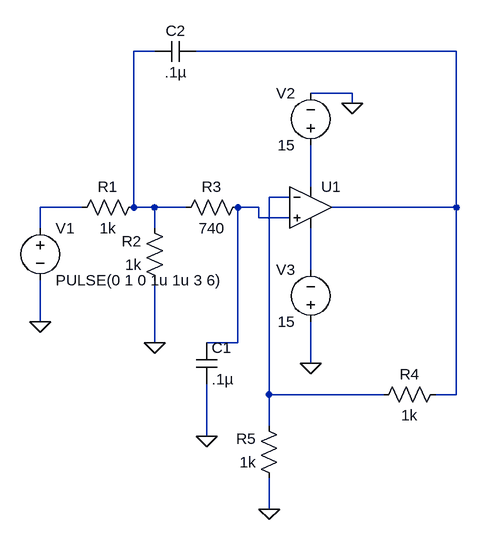
[diagram p0: schematic proj2circuit2.asc]
proj2circuit2.asc, the LTspice schematic file:
Version 4
SHEET 1 880 680
WIRE 48 -224 16 -224
WIRE 512 -224 112 -224
WIRE 352 -160 288 -160
WIRE 352 -144 352 -160
WIRE 288 -16 288 -80
WIRE 256 0 224 0
WIRE -64 16 -128 16
WIRE 16 16 16 -224
WIRE 48 16 16 16
WIRE 96 16 48 16
WIRE 208 16 176 16
WIRE 512 16 512 -224
WIRE 512 16 320 16
WIRE 208 32 208 16
WIRE 256 32 208 32
WIRE -128 48 -128 16
WIRE 48 48 48 16
WIRE 288 112 288 48
WIRE -128 192 -128 128
WIRE 48 224 48 128
WIRE 176 224 176 16
WIRE 176 224 128 224
WIRE 288 256 288 192
WIRE 224 304 224 0
WIRE 400 304 224 304
WIRE 512 304 512 16
WIRE 512 304 480 304
WIRE 224 352 224 304
WIRE 128 368 128 288
WIRE 224 480 224 432
FLAG -128 192 0
FLAG 352 -144 0
FLAG 288 256 0
FLAG 48 224 0
FLAG 128 368 0
FLAG 224 480 0
SYMBOL OpAmps\\UniversalOpamp2 288 16 R0
SYMATTR InstName U1
SYMBOL voltage -128 32 R0
WINDOW 123 0 0 Left 0
WINDOW 39 0 0 Left 0
SYMATTR InstName V1
SYMATTR Value PULSE(0 1 0 1u 1u 3 6)
SYMBOL voltage 288 -64 R180
WINDOW 0 24 96 Left 2
WINDOW 3 24 16 Left 2
WINDOW 123 0 0 Left 0
WINDOW 39 0 0 Left 0
SYMATTR InstName V2
SYMATTR Value 15
SYMBOL voltage 288 208 R180
WINDOW 0 24 96 Left 2
WINDOW 3 24 16 Left 2
WINDOW 123 0 0 Left 0
WINDOW 39 0 0 Left 0
SYMATTR InstName V3
SYMATTR Value 15
SYMBOL res 32 0 R90
WINDOW 0 0 56 VBottom 2
WINDOW 3 32 56 VTop 2
SYMATTR InstName R1
SYMATTR Value 1k
SYMBOL res 64 144 R180
WINDOW 0 36 76 Left 2
WINDOW 3 36 40 Left 2
SYMATTR InstName R2
SYMATTR Value 1k
SYMBOL res 192 0 R90
WINDOW 0 0 56 VBottom 2
WINDOW 3 32 56 VTop 2
SYMATTR InstName R3
SYMATTR Value 740
SYMBOL res 496 288 R90
WINDOW 0 0 56 VBottom 2
WINDOW 3 32 56 VTop 2
SYMATTR InstName R4
SYMATTR Value 1k
SYMBOL res 240 448 R180
WINDOW 0 36 76 Left 2
WINDOW 3 36 40 Left 2
SYMATTR InstName R5
SYMATTR Value 1k
SYMBOL cap 112 224 R0
SYMATTR InstName C1
SYMATTR Value .1µ
SYMBOL cap 112 -240 R90
WINDOW 0 0 32 VBottom 2
WINDOW 3 32 32 VTop 2
SYMATTR InstName C2
SYMATTR Value .1µ

The netlist it stands for:
* proj2circuit2.asc
XU1 N006 N004 N003 N007 N002 level.2 Avol=1Meg GBW=10Meg Slew=10Meg ilimit=25m rail=0 Vos=0 phimargin=45 en=0 enk=0 in=0 ink=0 Rin=500Meg  ; pins IN+ IN- V+ V- OUT
V1 N005 0 PULSE(0 1 0 1u 1u 3 6)
V2 N003 0 15
V3 0 N007 15
R1 N001 N005 1k
R2 0 N001 1k
R3 N006 N001 740
R4 N002 N004 1k
R5 0 N004 1k
C1 N006 0 .1µ
C2 N002 N001 .1µ
.lib UniversalOpamps2.sub
.backanno
.end